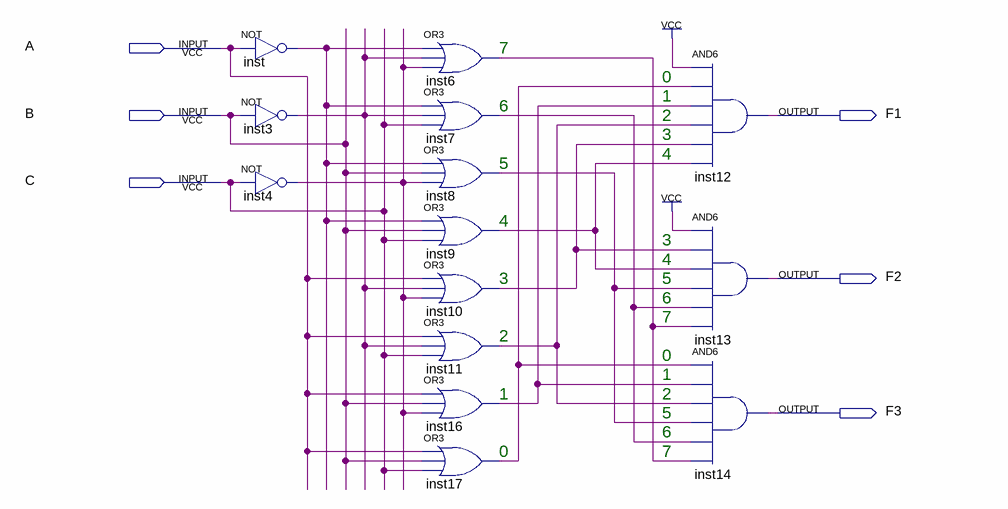
[diagram p0: schematic sheet]
// Quartus schematic voting_circuit-2.bdf as structural Verilog: 14 symbols, 6 pins
module \voting_circuit-2  (
  input  A,
  input  B,
  input  C,
  output F1,
  output F2,
  output F3
);

  wire inst3_out, inst4_out, inst6_out, inst7_out, inst8_out, inst9_out, inst10_out, inst11_out, inst16_out,
       inst17_out, inst_out;

  not inst (inst_out, A);
  not inst3 (inst3_out, B);
  not inst4 (inst4_out, C);
  or inst6 (inst6_out, inst_out, inst3_out, inst4_out);
  or inst7 (inst7_out, inst_out, inst3_out, C);
  or inst8 (inst8_out, inst_out, B, inst4_out);
  or inst9 (inst9_out, inst_out, B, C);
  or inst10 (inst10_out, A, inst3_out, inst4_out);
  or inst11 (inst11_out, A, inst3_out, C);
  or inst16 (inst16_out, A, B, inst4_out);
  or inst17 (inst17_out, A, B, C);
  and inst12 (F1, 1'b1, inst17_out, inst16_out, inst11_out, inst10_out, inst9_out);
  and inst13 (F2, 1'b1, inst10_out, inst9_out, inst8_out, inst7_out, inst6_out);
  and inst14 (F3, inst17_out, inst16_out, inst11_out, inst8_out, inst7_out, inst6_out);

  // Notes on the sheet:
  //   7
  //   0
  //   1
  //   6
  //   2
  //   3
  //   4
  //   5
  //   4
  //   3
  //   4
  //   3
  //   5
  //   6
  //   7
  //   2
  //   0
  //   1
  //   1
  //   2
  //   5
  //   6
  //   0
  //   7
endmodule
